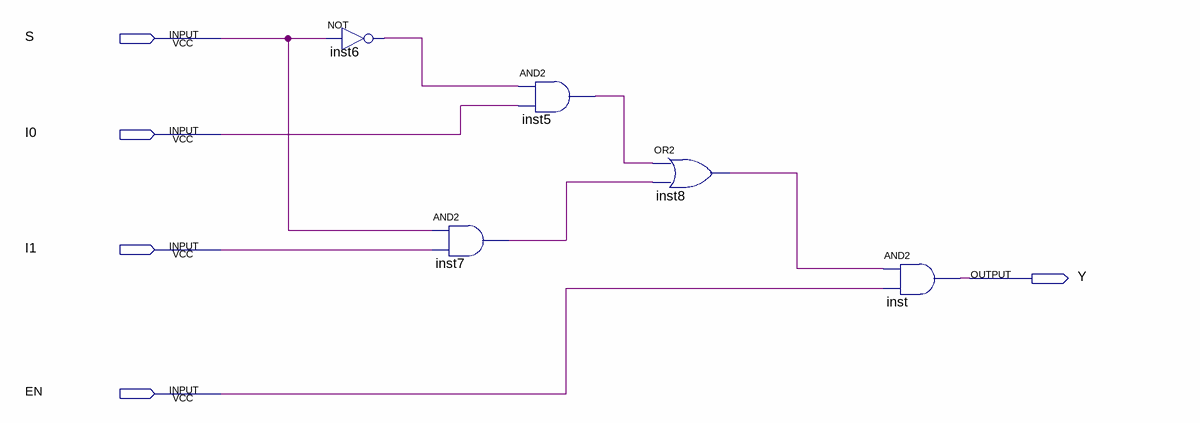
[diagram p0: schematic sheet]
// Quartus schematic Mux2_1.bdf as structural Verilog: 5 symbols, 5 pins
module Mux2_1 (
  input  S,
  input  I0,
  input  I1,
  input  EN,
  output Y
);

  wire inst5_out, inst6_out, inst7_out, inst8_out;

  not inst6 (inst6_out, S);
  and inst7 (inst7_out, S, I1);
  and inst5 (inst5_out, inst6_out, I0);
  or inst8 (inst8_out, inst5_out, inst7_out);
  and inst (Y, inst8_out, EN);
endmodule
